# EAGLE design magnilamp_led (EAGLE 9.6.2)
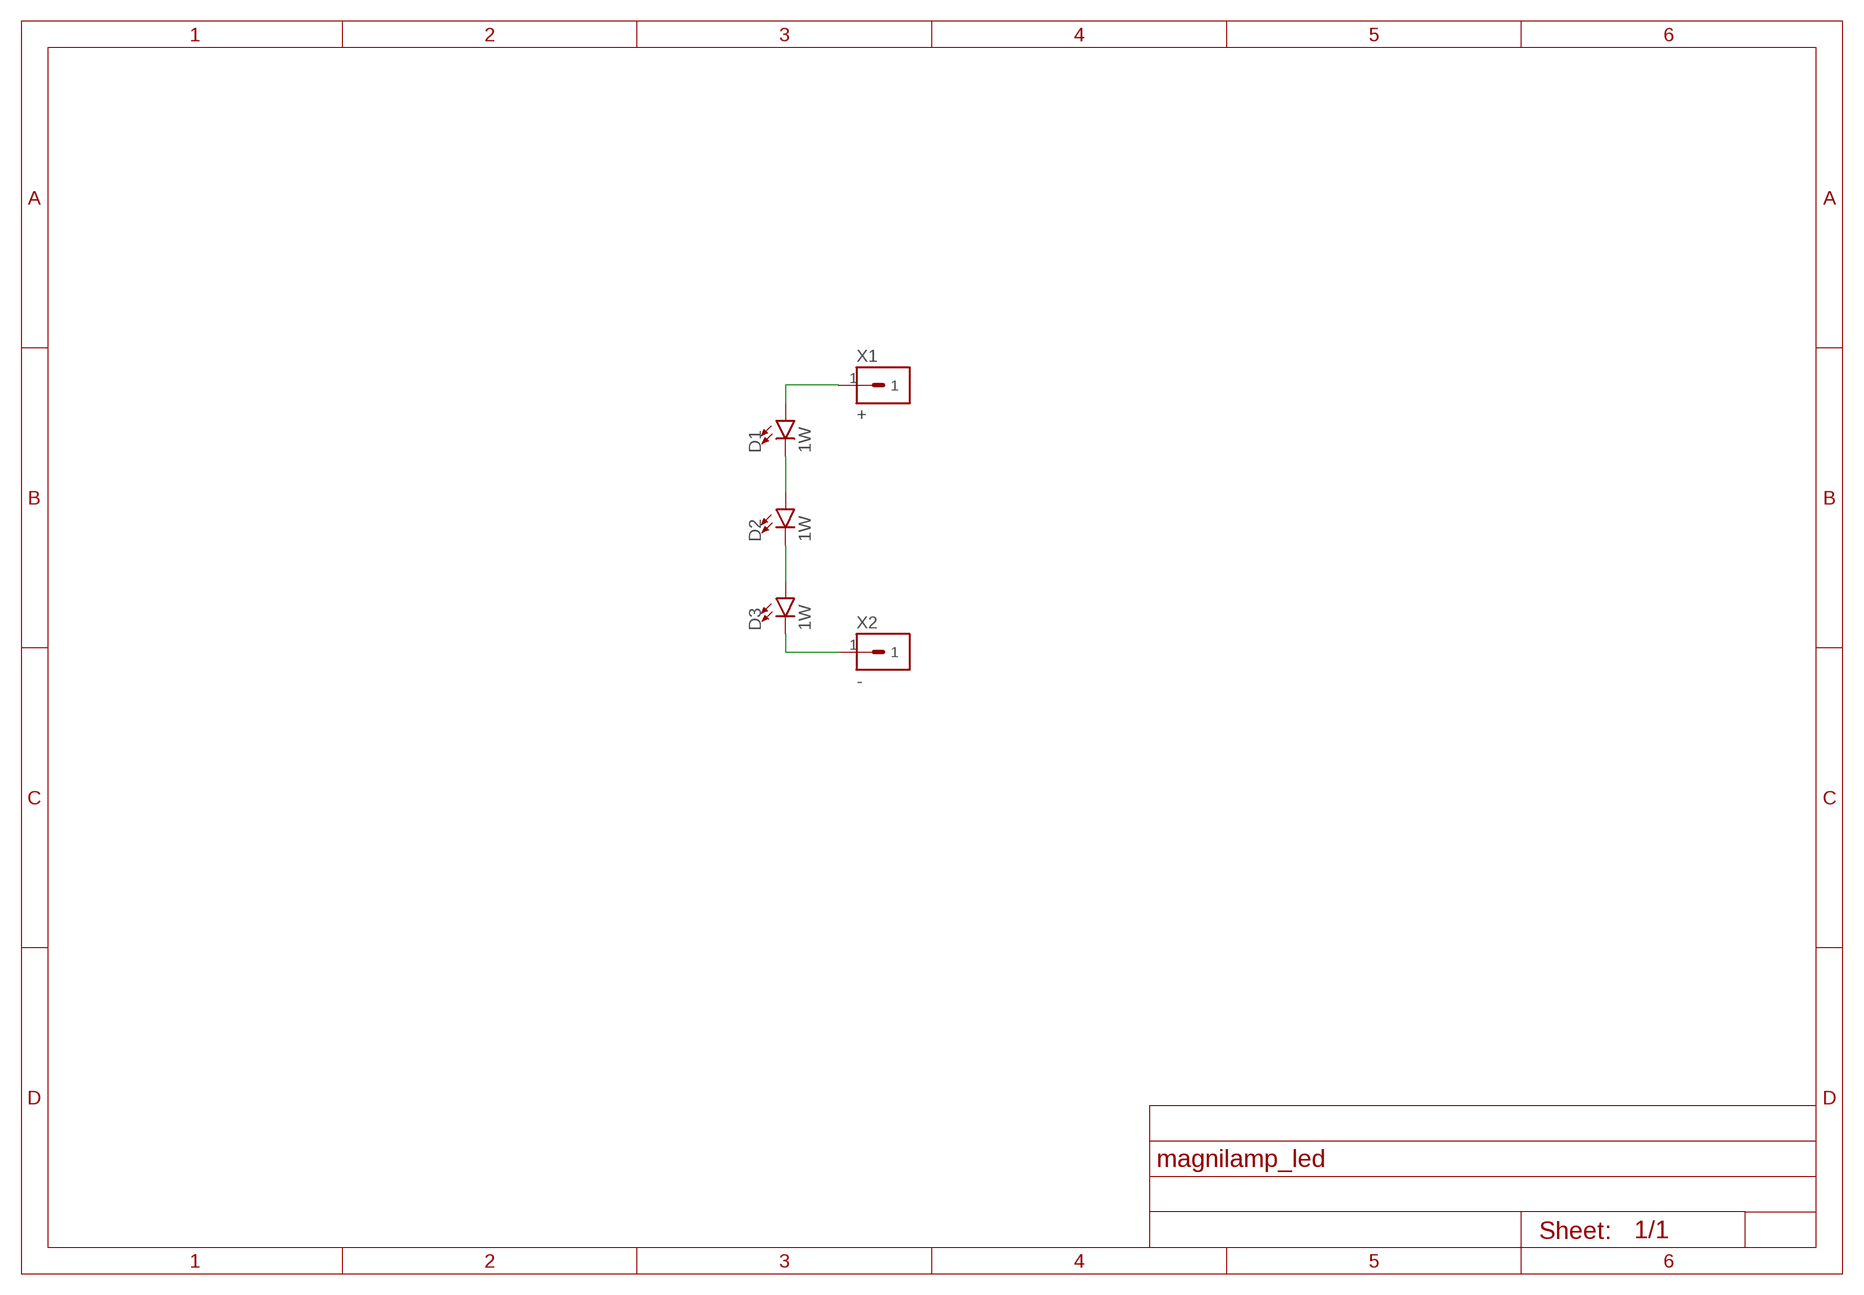
[diagram p0: schematic, sheet 1]

## Parts
D1  1W  LED1W  [LED_1W]
D2  1W  LED1W  [LED_1W]
D3  1W  LED1W  [LED_1W]
X1  +  SOLDERPAD4X5  [SOLDERPAD-4X5]
X2  -  SOLDERPAD4X5  [SOLDERPAD-4X5]

## Nets
N$1: D1.A X1.1
N$2: D1.C D2.A
N$3: D2.C D3.A
N$4: D3.C X2.1

## Library data of the parts
D1-D3 = M2M-LED:LED: LED (Generic) Standard schematic elements and footprints for 5mm, 3mm, 1206, and 0603 sized LEDs. Generic LEDs with no color specified.
X1 X2 = M2M-Connectors:SOLDERPAD

## Board
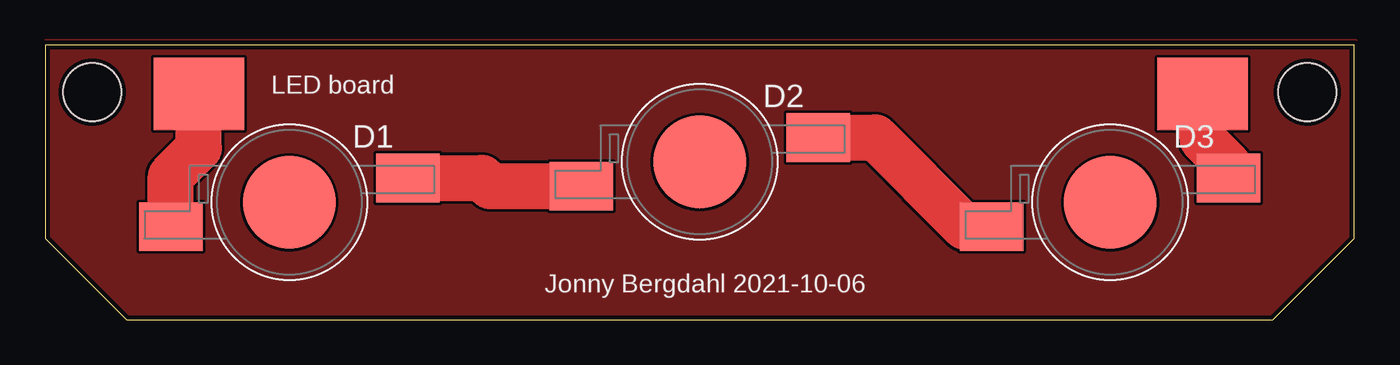
[diagram p1: board, top side]

Size 72.4 x 15.2 mm. Coordinates in mm from the lower left corner, seen from the top.
Outline: 0,15.2 0,4.5 4.5,0 67.9,0 72.4,4.5 72.4,15.2 0,15.2
Copper layers (1*16): Top 0.035mm / dielectric 1.5mm / Bottom 0.035mm
Design rules "SeeedStudio_2layer_DRU_no_angle_20140221": minimum track width 6mil, minimum drill 0.3mm, track to track 6mil, track to pad 6mil, pad to pad 6mil, via to via 6mil, smd to smd 0mil, copper to edge 10mil, drill to drill 10mil, minimum pad ring 2mil, minimum via ring 6mil, stop-mask expansion 2mil, vias tented up to drill 1000mil, thermal gap 10mil
Holes 3.2 mm at 2.6,12.6 69.8,12.6

### Footprints (pad centres in the part's own frame; a part is rotated, then mirrored left to right if it is on the bottom)
LED_1W = smd 3.5 x 2.7: A -6.55,-1.35; C 6.55,1.35 | smd 5.15 x 5.15: P$2 0,0
SOLDERPAD-4X5 = smd 4 x 5: 1 0,0

### Placement (x,y rotation side)
D1  13.5,6.5 0 top
D2  36.2,8.74 0 top
D3  58.9,6.5 0 top
X1  8.5,12.5 270 top
X2  64,12.5 90 top

### Tracks (layer width: path | path; a pad name or v marks a point on that pad's centre or on a via)
N$1
  Top 2.54: D1.A 6.95,7.95 8.5,9.5 X1.1
N$2
  Top 2.54: D1.C 24.15,7.85 24.61,7.39 D2.A
N$3
  Top 2.54: D2.C 45.91,10.09 50.85,5.15 D3.A
N$4
  Top 2.54: D3.C 65.45,8.55 64,10 X2.1
P$2
  pour Top: 0,15.5 72.5,15.5 72.5,4.5 68,0 4.5,0 0,4.5

### Text on the board
tPlace: LED board | Jonny Bergdahl 2021-10-06